# EAGLE schematic 00C-004 (EAGLE 6.3)

## Sheet 1 of 2
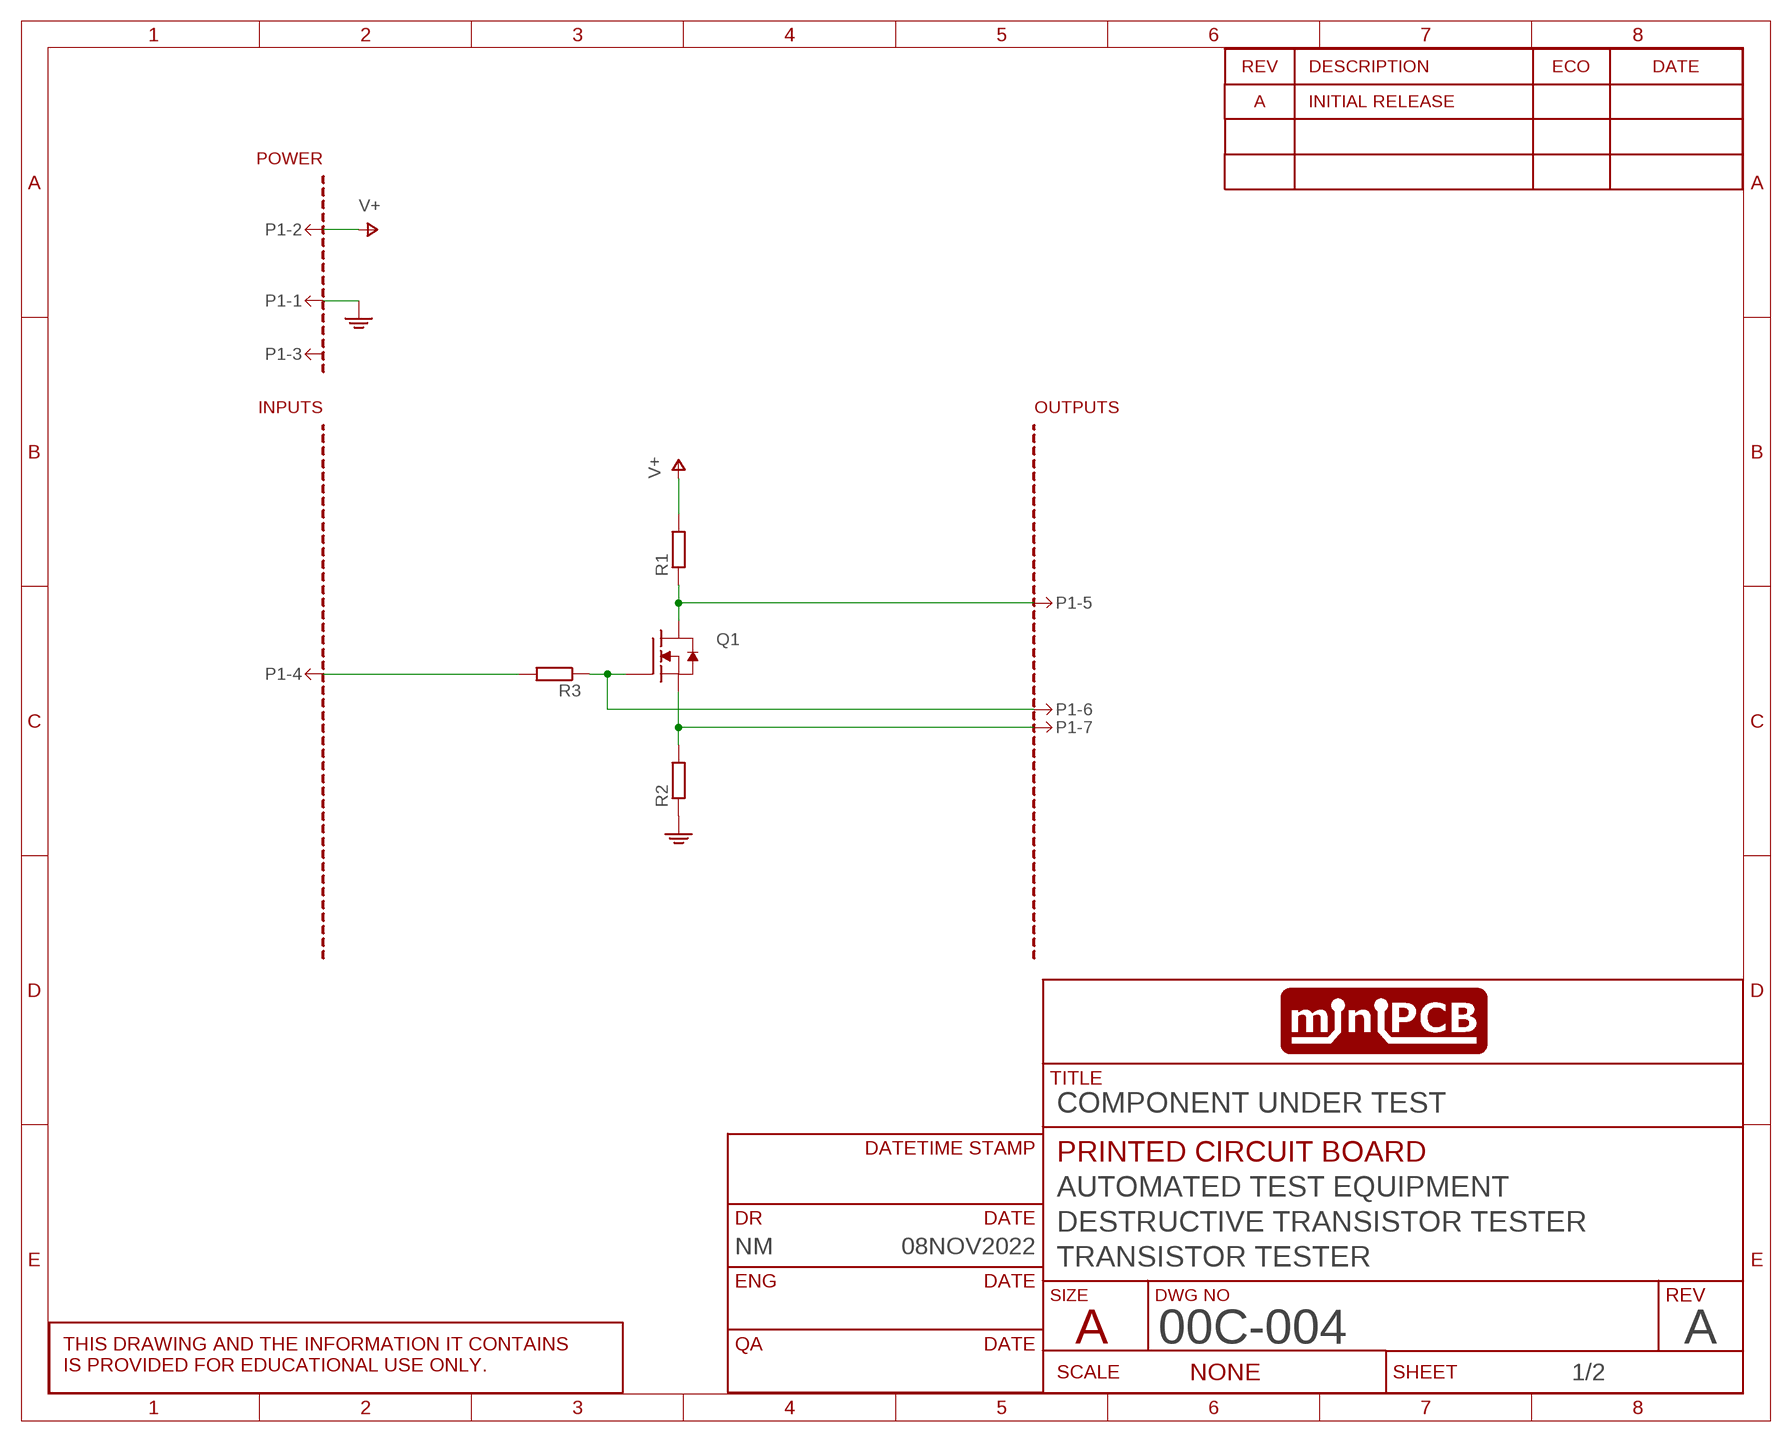
[diagram p0: schematic, sheet 1]
SHEET1 (SCHEMATIC): CIRCUIT_CATEGORY: AUTOMATED TEST EQUIPMENT; CIRCUIT_NAME: DESTRUCTIVE TRANSISTOR TESTER; CIRCUIT_VARIANT: TRANSISTOR TESTER; DR: NM; DR_DATE: 08NOV2022; PCB_PCBA: PRINTED CIRCUIT BOARD; REVA: A; REVISION: A; TITLE: COMPONENT UNDER TEST

### Parts
P1-  MINIPCB_7P50X100  [MINIPCB_7P_50X100]
Q1  MOSFET-NDPAK  [DPACK]
R1  RESISTORTHD  [0204/7]
R2  RESISTORTHD  [0204/7]
R3  RESISTORTHD  [0204/7]

### Nets
GND: P1-.1 R2.1
N$1: P1-.5 Q1.4(D) R1.1
N$2: P1-.7 Q1.3(S) R2.2
N$3: P1-.6 Q1.1(G) R3.1
N$4: P1-.4 R3.2
V+: P1-.2 R1.2
Unconnected: P1-.3

## Sheet 2 of 2
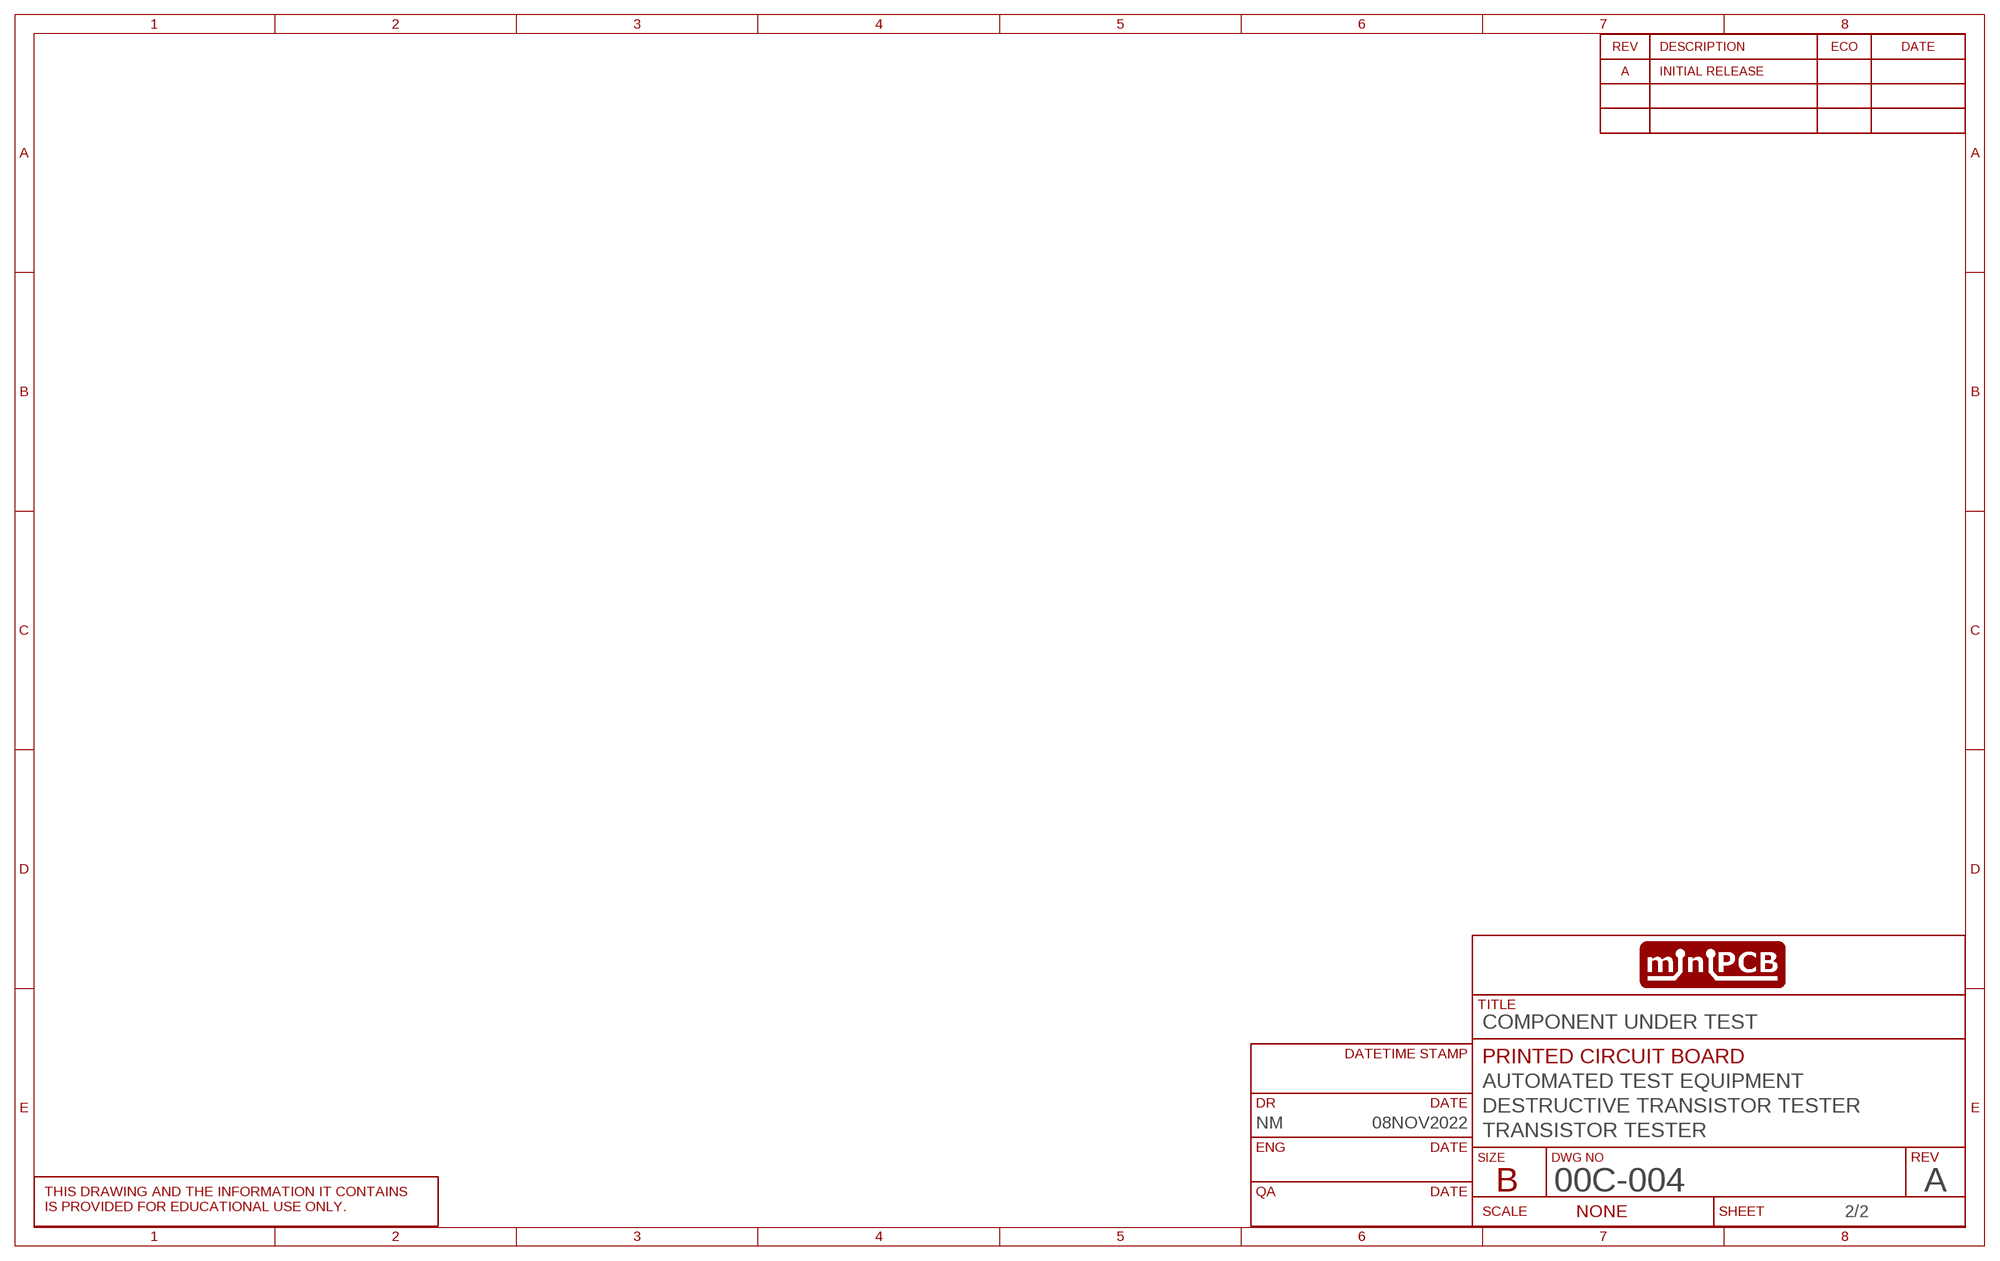
[diagram p1: schematic, sheet 2]

## Library data of the parts
P1- = minipcb:MINIPCB_7P
Q1 = minipcb:MOSFET-N
R1-R3 = minipcb:RESISTOR